# EAGLE design d11_micro_vcp_v4 (EAGLE 7.3.0)
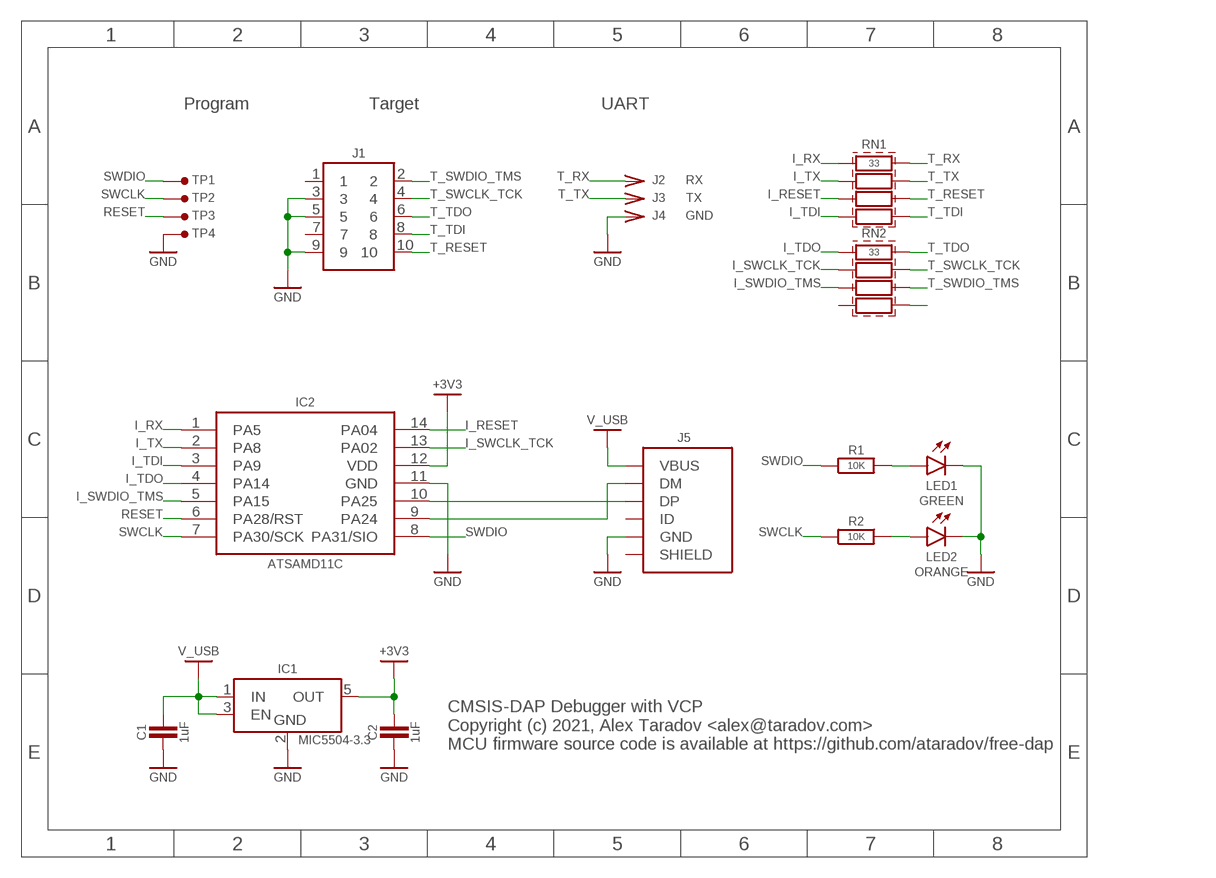
[diagram p0: schematic, sheet 1]

## Parts
C1  1uF  C-0603  [SMD0603]
C2  1uF  C-0603  [SMD0603]
IC1  MIC5504-3.3  MIC5504-SOT23-5  [SOT23-5]
IC2  ATSAMD11C  [SO-14]
J1  HEADER-5X2-TH-1.27  [HEADER-5X2-1.27MM]
J2  RX  CONN-SINGLE-TH  [PIN-TH]
J3  TX  CONN-SINGLE-TH  [PIN-TH]
J4  GND  CONN-SINGLE-TH  [PIN-TH]
J5  USB-B-MICRO-SMT  [USB-B-MICRO-SMT-SHELL-TH]
LED1  GREEN  LED_SMDLED_0603  [SMD0603]
LED2  ORANGE  LED_SMDLED_0603  [SMD0603]
R1  10K  R-0603  [SMD0603]
R2  10K  R-0603  [SMD0603]
RN1  33  RN-4-0603-X4  [SMD0603-X4]
RN2  33  RN-4-0603-X4  [SMD0603-X4]
TP1  TEST-POINT-1.27MM  [TP-1.27MM]
TP2  TEST-POINT-1.27MM  [TP-1.27MM]
TP3  TEST-POINT-1.27MM  [TP-1.27MM]
TP4  TEST-POINT-1.27MM  [TP-1.27MM]

## Nets
+3V3: C2.2 IC1.5(OUT) IC2.12(VDD)
GND: C1.1 C2.1 IC1.2(GND) IC2.11(GND) J1.3 J1.5 J1.9 J4.1 J5.5(GND) LED1.2(C) LED2.2(C) TP4.1
I_RESET: IC2.14(PA04) RN1.3
I_RX: IC2.1(PA5) RN1.1
I_SWCLK_TCK: IC2.13(PA02) RN2.2
I_SWDIO_TMS: IC2.5(PA15) RN2.3
I_TDI: IC2.3(PA9) RN1.4
I_TDO: IC2.4(PA14) RN2.1
I_TX: IC2.2(PA8) RN1.2
N$1: IC2.9(PA24) J5.2(DM)
N$2: IC2.10(PA25) J5.3(DP)
N$4: LED1.1(A) R1.2
N$6: LED2.1(A) R2.2
N$18: RN2.5
RESET: IC2.6(PA28/RST) TP3.1
SWCLK: IC2.7(PA30/SCK) R2.1 TP2.1
SWDIO: IC2.8(PA31/SIO) R1.1 TP1.1
T_RESET: J1.10 RN1.6
T_RX: J2.1 RN1.8
T_SWCLK_TCK: J1.4 RN2.7
T_SWDIO_TMS: J1.2 RN2.6
T_TDI: J1.8 RN1.5
T_TDO: J1.6 RN2.8
T_TX: J3.1 RN1.7
V_USB: C1.2 IC1.1(IN) IC1.3(EN) J5.1(VBUS)
Unconnected: J1.1 J1.7 J5.4(ID) J5.M1(SHIELD) J5.M2(SHIELD) J5.M3(SHIELD) J5.M4(SHIELD) RN2.4

## Notes on the sheet
- Program | Target | UART
- CMSIS-DAP Debugger with VCP
  Copyright (c) 2021, Alex Taradov <alex@taradov.com>
  MCU firmware source code is available at https://github.com/ataradov/free-dap

## Library data of the parts
C1 C2 = ataradov_rlc:C
IC1 = ataradov_vreg:MIC5504: LM1117 voltage regulator
IC2 = ataradov_mcu:ATSAMD11C
J1 = ataradov_conn:HEADER-5X2
J2-J4 = ataradov_conn:CONN-SINGLE
J5 = ataradov_conn:USB-B-MICRO
LED1 LED2 = ataradov_led:LED_SMD: SMD_LED
R1 R2 = ataradov_rlc:R
RN1 RN2 = ataradov_rlc:RN-4
TP1-TP4 = ataradov_misc:TEST-POINT: Test Point

## Board
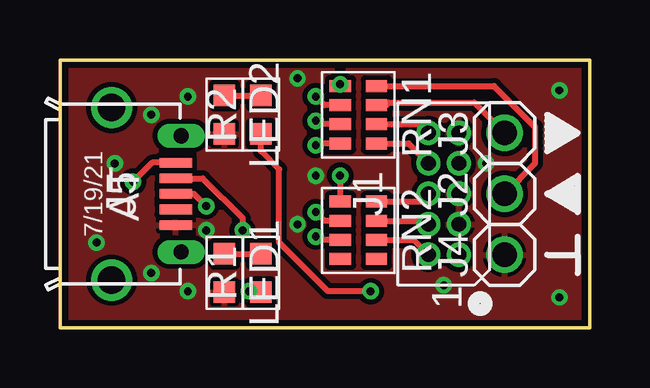
[diagram p1: board, top side]
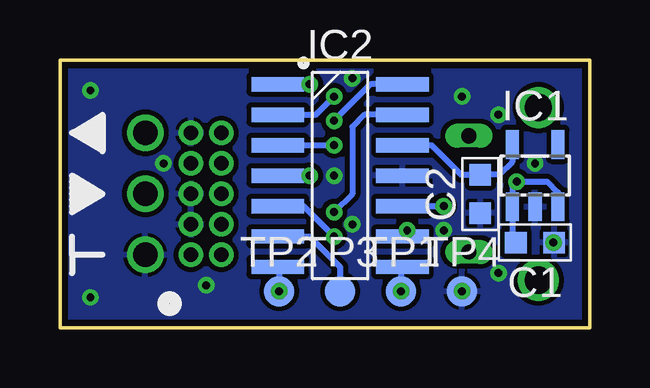
[diagram p2: board, bottom side, seen from below]

Size 22.1 x 11.18 mm. Coordinates in mm from the lower left corner, seen from the top.
Outline: 0,0 22.1,0 22.1,11.18 0,11.18 0,0
Copper layers (1*16): Top 0.0356mm / dielectric 1.5011mm / Bottom 0.0356mm
Design rules "std-tented-new": minimum track width 8mil, minimum drill 12mil, track to track 6mil, track to pad 6mil, pad to pad 6mil, via to via 6mil, smd to smd 0mil, copper to edge 10mil, drill to drill 6mil, minimum pad ring 7mil, minimum via ring 7mil, stop-mask expansion 3mil, vias tented up to drill 25mil, thermal gap 6mil

### Footprints (pad centres in the part's own frame; a part is rotated, then mirrored left to right if it is on the bottom)
SMD0603 = smd 0.9 x 0.9: 1 -0.8,0; 2 0.8,0
SOT23-5 = smd 0.55 x 1.2: 1 -0.95,-1.3; 2 0,-1.3; 3 0.95,-1.3; 4 0.95,1.3; 5 -0.95,1.3
SO-14 = smd 0.6 x 2.2: 1 -3.81,-2.6; 2 -2.54,-2.6; 3 -1.27,-2.6; 4 0,-2.6; 5 1.27,-2.6; 6 2.54,-2.6; 7 3.81,-2.6; 8 3.81,2.6; 9 2.54,2.6; 10 1.27,2.6; 11 0,2.6; 12 -1.27,2.6; 13 -2.54,2.6; 14 -3.81,2.6
HEADER-5X2-1.27MM = drill 0.61 pad 1.016: 1 -2.54,-0.635; 2 -2.54,0.635; 3 -1.27,-0.635; 4 -1.27,0.635; 5 0,-0.635; 6 0,0.635; 7 1.27,-0.635; 8 1.27,0.635; 9 2.54,-0.635; 10 2.54,0.635
PIN-TH = drill 1.016: 1 0,0
USB-B-MICRO-SMT-SHELL-TH = smd 1.35 x 0.4: 1 4.825,1.3; 2 4.825,0.65; 3 4.825,0; 4 4.825,-0.65; 5 4.825,-1.3 | drill 1.143: M1 2.15,-3.6; M2 2.15,3.6 | drill 0.635 long: M3 5.05,2.425; M4 5.05,-2.425
SMD0603-X4 = smd 0.5 x 0.889: 1 -1.2,-0.752; 2 -0.4,-0.752; 3 0.4,-0.752; 4 1.2,-0.752; 5 1.2,0.752; 6 0.4,0.752; 7 -0.4,0.752; 8 -1.2,0.752
TP-1.27MM = smd 1.27 x 1.27: 1 0,0

### Placement (x,y rotation side)
C1  2.29,3.56 180 bottom
C2  4.57,5.59 90 bottom
IC1  2.29,6.35 0 bottom
IC2  10.41,6.35 270 bottom
J1  16,5.59 90 top
J2  18.54,5.59 90 top
J3  18.54,8.13 90 top
J4  18.54,3.05 90 top
J5  0,5.59 0 top
LED1  6.86,2.29 270 top
LED2  6.86,8.89 270 top
R1  8.38,2.29 90 top
R2  8.38,8.89 90 top
RN1  12.45,8.89 270 top
RN2  12.45,4.06 270 top
TP1  7.87,1.52 0 bottom
TP2  12.95,1.52 0 bottom
TP3  10.41,1.52 0 bottom
TP4  5.33,1.52 0 bottom

### Tracks (layer width: path | path; a pad name or v marks a point on that pad's centre or on a via)
+3V3
  Bottom 0.254: IC1.5 3.24,6.92 3.77,6.39 C2.2 5.37,6.39 6.6,7.62 IC2.12
GND  (via drill 0.33 pad 0.25)
  other vias: 3.81,8.89 3.81,2.29 6.1,4.06 2.29,6.86 5.33,1.52 1.52,3.56 9.91,10.41 10.67,6.35 9.91,4.32 17.78,6.86 20.83,9.91 16,1.78 20.83,1.27 5.33,9.65
  pour Bottom (isolate 0.203): 0,11.18 22.1,11.18 22.1,0 0,0
  pour Top (isolate 0.203): 0,11.18 22.1,11.18 22.1,0 0,0
I_RESET  (via drill 0.33 pad 0.51)
  Top 0.254: RN1.3 10.81,8.49 v10.67,8.64
  Bottom 0.254: IC2.14 9.14,10.16 v10.67,8.64
I_RX  (via drill 0.33)
  Top 0.254: RN1.1 11.69,10.15 v11.68,10.16
  Bottom 0.254: IC2.1 v11.68,10.16
I_SWCLK_TCK  (via drill 0.33 pad 0.51)
  Top 0.254: RN2.2 11.03,4.46 v10.67,4.83
  Bottom 0.254: IC2.13 9.4,8.89 9.91,8.38 9.91,5.59 v10.67,4.83
I_SWDIO_TMS  (via drill 0.33)
  Top 0.254: RN2.3 10.81,3.66 v10.67,3.81
  Bottom 0.254: v10.67,3.81 11.94,5.08 IC2.5
I_TDI  (via drill 0.33)
  Top 0.254: RN1.4 10.74,7.69 v10.67,7.62
  Bottom 0.254: IC2.3 v10.67,7.62
I_TDO  (via drill 0.33)
  Top 0.254: v11.68,6.35 11.68,5.27 RN2.1
  Bottom 0.254: IC2.4 v11.68,6.35
I_TX  (via drill 0.33)
  Top 0.254: RN1.2 11.03,9.29 v10.67,9.65
  Bottom 0.254: IC2.2 11.43,8.89 v10.67,9.65
N$1  (via drill 0.33 pad 0.25)
  Top 0.254: J5.2 5.95,6.24 7.62,4.57 v7.62,4.06
  Bottom 0.254: v7.62,4.06 7.62,4 IC2.9
N$2  (via drill 0.33 pad 0.25)
  Top 0.254: J5.3 5.59,5.59 v6.1,5.08
  Bottom 0.254: IC2.10 v6.1,5.08
N$4
  Top 0.254: LED1.1 R1.2
N$6
  Top 0.254: LED2.1 R2.2
RESET
  Bottom 0.254: IC2.6 11.68,3.81 10.41,2.54 TP3.1
SWCLK  (via drill 0.33)
  Top 0.254: TP2.1 11.18,1.52 9.14,3.56 9.14,6.6 8.38,7.37 R2.1
  Bottom 0.254: IC2.7 12.95,2.48 TP2.1
  other vias: 12.95,1.52
SWDIO  (via drill 0.33)
  Top 0.254: R1.1 8.34,1.52 TP1.1
  Bottom 0.254: IC2.8 7.87,2.48 TP1.1
  other vias: 7.87,1.52
T_RESET
  Top 0.254: RN1.6 15.01,8.49 J1.10
T_RX
  Top 0.254: RN1.8 18.1,10.09 19.81,8.38 19.81,6.86 J2.1
T_SWCLK_TCK
  Top 0.254: RN2.7 15.22,4.46 J1.4
T_SWDIO_TMS
  Top 0.254: RN2.6 14.75,3.66 J1.2
T_TDI
  Top 0.254: RN1.5 14.54,7.69 J1.8
T_TDO
  Top 0.254: RN2.8 15.04,5.26 J1.6
T_TX
  Top 0.254: RN1.7 13.61,9.29 13.72,9.4 17.27,9.4 J3.1
V_USB  (via drill 0.33)
  Top 0.254: J5.1 3.84,6.89 v3.05,6.1
  Bottom 0.254: IC1.3 1.34,5.65 1.78,6.1 v3.05,6.1 3.24,5.91 IC1.1 3.24,3.71 C1.2

### Text on the board
tPlace: 7/19/21 | AT | 1